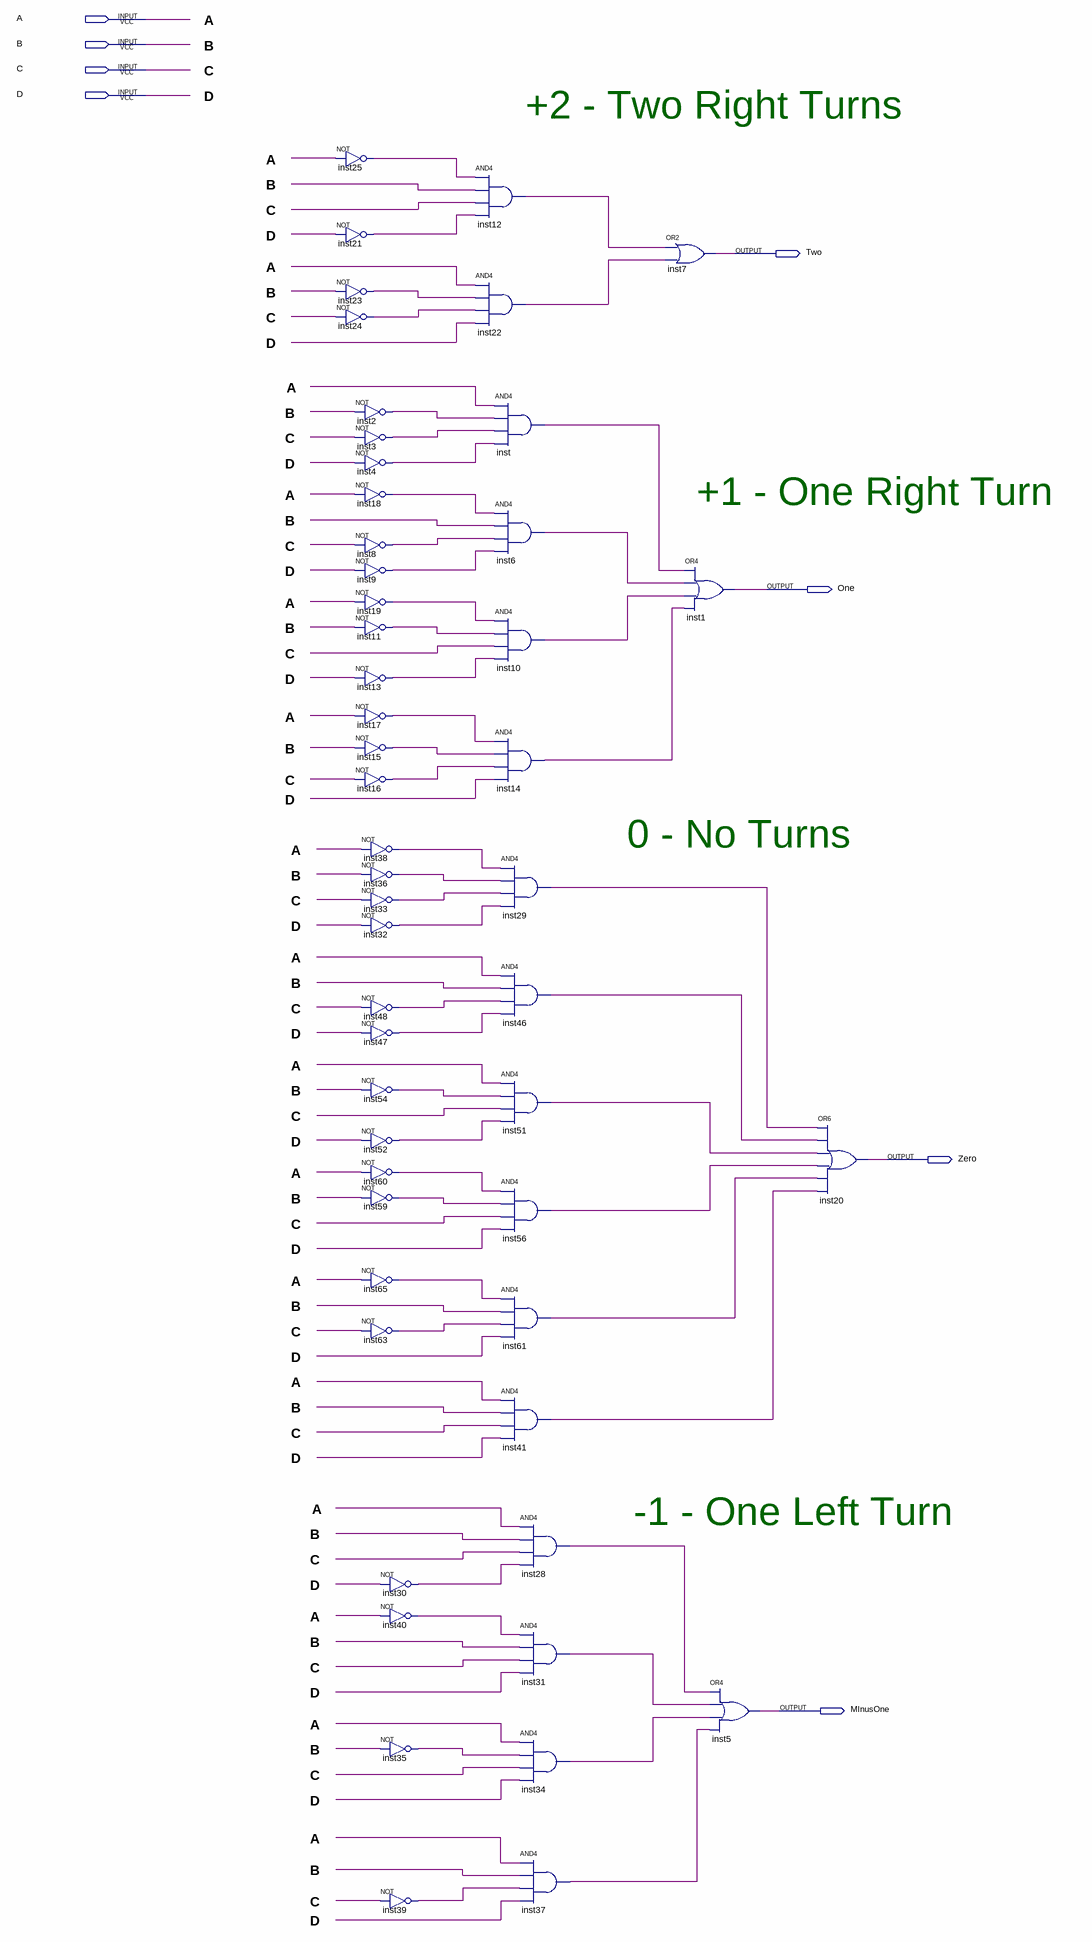
[diagram p0: schematic sheet]
// Quartus schematic CLUSTER_Module.bdf as structural Verilog: 52 symbols, 8 pins
module CLUSTER_Module (
  input  A,
  input  B,
  input  C,
  input  D,
  output Two,
  output One,
  output Zero,
  output MInusOne
);

  wire inst2_out, inst3_out, inst4_out, inst6_out, inst8_out, inst9_out, inst10_out, inst11_out, inst12_out,
       inst13_out, inst14_out, inst15_out, inst16_out, inst17_out, inst18_out, inst19_out, inst21_out,
       inst22_out, inst23_out, inst24_out, inst25_out, inst28_out, inst29_out, inst30_out, inst31_out,
       inst32_out, inst33_out, inst34_out, inst35_out, inst36_out, inst37_out, inst38_out, inst39_out,
       inst40_out, inst41_out, inst46_out, inst47_out, inst48_out, inst51_out, inst52_out, inst54_out,
       inst56_out, inst59_out, inst60_out, inst61_out, inst63_out, inst65_out, inst_out;

  not inst25 (inst25_out, A);
  not inst21 (inst21_out, D);
  not inst23 (inst23_out, B);
  not inst24 (inst24_out, C);
  not inst2 (inst2_out, B);
  not inst3 (inst3_out, C);
  not inst4 (inst4_out, D);
  not inst18 (inst18_out, A);
  not inst8 (inst8_out, C);
  not inst9 (inst9_out, D);
  not inst19 (inst19_out, A);
  not inst11 (inst11_out, B);
  not inst13 (inst13_out, D);
  not inst17 (inst17_out, A);
  not inst15 (inst15_out, B);
  not inst16 (inst16_out, C);
  not inst38 (inst38_out, A);
  not inst36 (inst36_out, B);
  not inst33 (inst33_out, C);
  not inst32 (inst32_out, D);
  not inst48 (inst48_out, C);
  not inst47 (inst47_out, D);
  not inst54 (inst54_out, B);
  not inst52 (inst52_out, D);
  not inst60 (inst60_out, A);
  not inst59 (inst59_out, B);
  not inst65 (inst65_out, A);
  not inst63 (inst63_out, C);
  not inst30 (inst30_out, D);
  not inst40 (inst40_out, A);
  not inst35 (inst35_out, B);
  not inst39 (inst39_out, C);
  and inst12 (inst12_out, inst25_out, B, C, inst21_out);
  and inst22 (inst22_out, A, inst23_out, inst24_out, D);
  and inst (inst_out, A, inst2_out, inst3_out, inst4_out);
  and inst6 (inst6_out, inst18_out, B, inst8_out, inst9_out);
  and inst10 (inst10_out, inst19_out, inst11_out, C, inst13_out);
  and inst14 (inst14_out, inst17_out, inst15_out, inst16_out, D);
  and inst29 (inst29_out, inst38_out, inst36_out, inst33_out, inst32_out);
  and inst46 (inst46_out, A, B, inst48_out, inst47_out);
  and inst51 (inst51_out, A, inst54_out, C, inst52_out);
  and inst56 (inst56_out, inst60_out, inst59_out, C, D);
  and inst61 (inst61_out, inst65_out, B, inst63_out, D);
  and inst41 (inst41_out, A, B, C, D);
  and inst28 (inst28_out, A, B, C, inst30_out);
  and inst31 (inst31_out, inst40_out, B, C, D);
  and inst34 (inst34_out, A, inst35_out, C, D);
  and inst37 (inst37_out, A, B, inst39_out, D);
  or inst7 (Two, inst12_out, inst22_out);
  or inst1 (One, inst_out, inst6_out, inst10_out, inst14_out);
  or inst5 (MInusOne, inst28_out, inst31_out, inst34_out, inst37_out);
  or inst20 (Zero, inst29_out, inst46_out, inst51_out, inst56_out, inst61_out, inst41_out);

  // Notes on the sheet:
  //   +2 - Two Right Turns
  //   +1 - One Right Turn
  //   0 - No Turns
  //   -1 - One Left Turn
endmodule
